# EAGLE design cmoy (EAGLE 6.4)
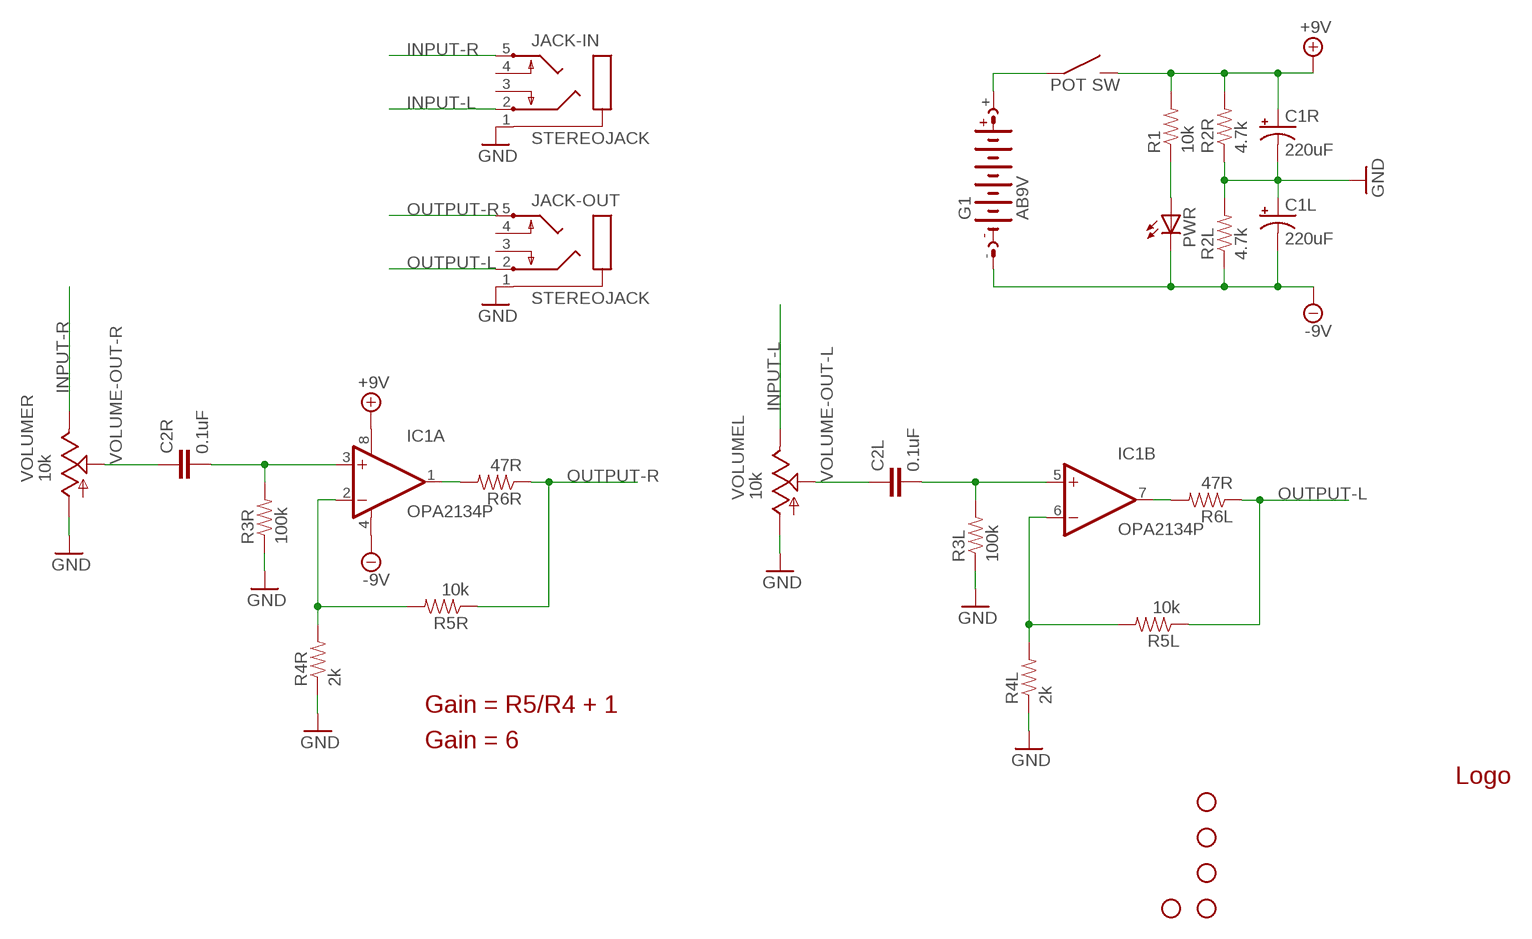
[diagram p0: schematic, sheet 1]

## Parts
C1L  220uF  CAP_POL-RADIAL-6.3MM  [CPOL-RADIAL-6.3MM]
C1R  220uF  CAP_POL-RADIAL-6.3MM  [CPOL-RADIAL-6.3MM]
C2L  0.1uF  CAP-VIMA-MKS2D031001  [CAP-PTH-VIMA-MKS2C031001A00KSSD]
C2R  0.1uF  CAP-VIMA-MKS2D031001  [CAP-PTH-VIMA-MKS2C031001A00KSSD]
G1  AB9V  [AB9V]
IC1  OPA2134P  [DIL-8]
JACK-IN  STEREOJACK  [STX3100]
JACK-OUT  STEREOJACK  [STX3100]
JP1  STAND-OFF  [STAND-OFF]
JP2  STAND-OFF  [STAND-OFF]
JP3  STAND-OFF  [STAND-OFF]
JP4  STAND-OFF  [STAND-OFF]
JP5  STAND-OFF  [STAND-OFF]
PWR  LED-3MM-MINUS  [LED3MM-MINUS]
R1  10k  RESISTOR-PTH-1/6W-OUTLINE  [1/6W-RES-OUTLINE]
R2L  4.7k  RESISTOR-PTH-1/6W-OUTLINE  [1/6W-RES-OUTLINE]
R2R  4.7k  RESISTOR-PTH-1/6W-OUTLINE  [1/6W-RES-OUTLINE]
R3L  100k  RESISTOR-PTH-1/4W-OUTLINE  [1/4W-RES-OUTLINE]
R3R  100k  RESISTOR-PTH-1/4W-OUTLINE  [1/4W-RES-OUTLINE]
R4L  2k  RESISTOR-PTH-1/4W-OUTLINE  [1/4W-RES-OUTLINE]
R4R  2k  RESISTOR-PTH-1/4W-OUTLINE  [1/4W-RES-OUTLINE]
R5L  10k  RESISTOR-PTH-1/4W-OUTLINE  [1/4W-RES-OUTLINE]
R5R  10k  RESISTOR-PTH-1/4W-OUTLINE  [1/4W-RES-OUTLINE]
R6L  47R  RESISTOR-PTH-1/4W-OUTLINE  [1/4W-RES-OUTLINE]
R6R  47R  RESISTOR-PTH-1/4W-OUTLINE  [1/4W-RES-OUTLINE]
U$1  OSHW-LOGO-OUTLINE  [OSHW-LOGO-OUTLINE]
VOLUME  10k  ALPS_RK0971221Z0N  [ALPS_RK0971221Z0X]

## Nets
+9V: C1R.1(+) IC1.8(A:V+) R1.2 R2R.2 VOLUME.S2
-9V: C1L.2(-) G1.- IC1.4(A:V-) PWR.K(C) R2L.1
GND: C1L.1(+) C1R.2(-) JACK-IN.1 JACK-OUT.1 R2L.2 R2R.1 R3L.P$1 R3R.P$1 R4L.P$1 R4R.P$1 VOLUME.G1 VOLUME.G2
INPUT-L: JACK-IN.2 VOLUME.I1
INPUT-R: JACK-IN.5 VOLUME.I2
L+: C2L.2 IC1.5(B:+IN) R3L.P$2
L-: IC1.6(B:-IN) R4L.P$2 R5L.P$2
N$1: PWR.A R1.1
N$3: G1.+ VOLUME.S1
OP-L: IC1.7(B:OUT) R6L.P$2
OP-R: IC1.1(A:OUT) R6R.P$2
OUTPUT-L: JACK-OUT.2 R5L.P$1 R6L.P$1
OUTPUT-R: JACK-OUT.5 R5R.P$1 R6R.P$1
R+: C2R.2 IC1.3(A:+IN) R3R.P$2
R-: IC1.2(A:-IN) R4R.P$2 R5R.P$2
VOLUME-OUT-L: C2L.1 VOLUME.O1
VOLUME-OUT-R: C2R.1 VOLUME.O2
Unconnected: JACK-IN.3 JACK-IN.4 JACK-OUT.3 JACK-OUT.4

## Notes on the sheet
- Gain = R5/R4 + 1
- Gain = 6

## Library data of the parts
C1L C1R = akafugu:CAP_POL: Capacitor Polarized These are standard SMD and PTH capacitors. Normally 10uF, 47uF, and 100uF in electrolytic and tantalum varieties. Always verify the external diameter of the through hole cap, it varies with capacity, voltage, and manufacturer. The EIA devices should be standard.
C2L C2R = akafugu:CAP: Capacitor Standard 0603 ceramic capacitor, and 0.1" leaded capacitor.
G1 = battery:AB9V: 9-V BATTERY CLIP
IC1 = akafugu:OPA2134: Operational Amplifier
JACK-IN JACK-OUT = akafugu:STEREOJACK: MIC/HEADPHONE JACK Stereo jack with two switches. Kycon STX3100, CUI SJ1-3555NG and/or 4UCon 05544
JP1-JP5 = SparkFun:STAND-OFF: Stand Off This is the mechanical footprint for a #4 phillips button head screw. Use the keepout ring to avoid running the screw head into surrounding components. SKU : PRT-00447
PWR = akafugu:LED: LEDs Standard schematic elements and footprints for 5mm, 3mm, 1206, and 0603 sized LEDs. 5mm - Spark Fun Electronics SKU : COM-00529 (and others)
R1 R2L R2R R3L R3R R4L R4R R5L R5R R6L R6R = akafugu:RESISTOR: Resistor Basic schematic elements and footprints for 0603, 1206, and PTH resistors.
U$1 = akafugu:OSHW-LOGO
VOLUME = audio-pots:ALPS_RK0971221Z0*: ALPS RK0971221Z Dual-gang 9mm potentiometer for volume control, with SPST switch -05 model: 10K with "volume" taper -0N model: 50K with traditional audio taper

## Net classes
0 default: width 0.254 mm, drill 0.305 mm, clearance 0.152 mm

## Board
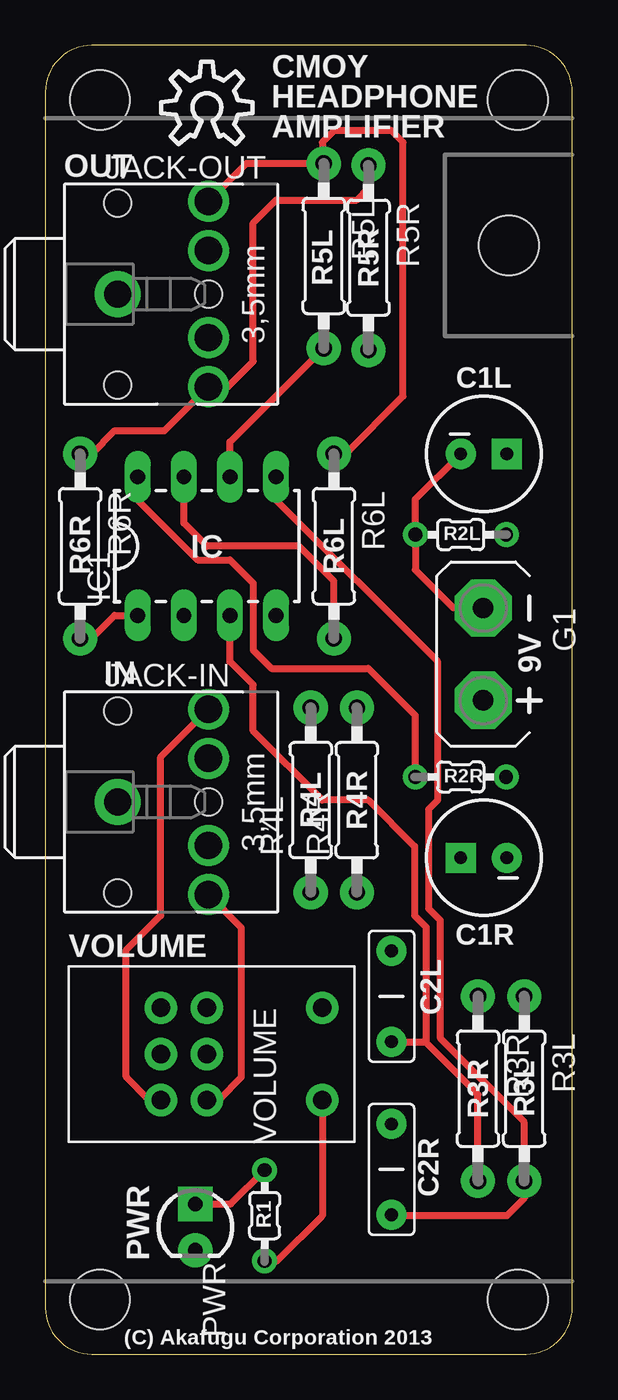
[diagram p1: board, top side]
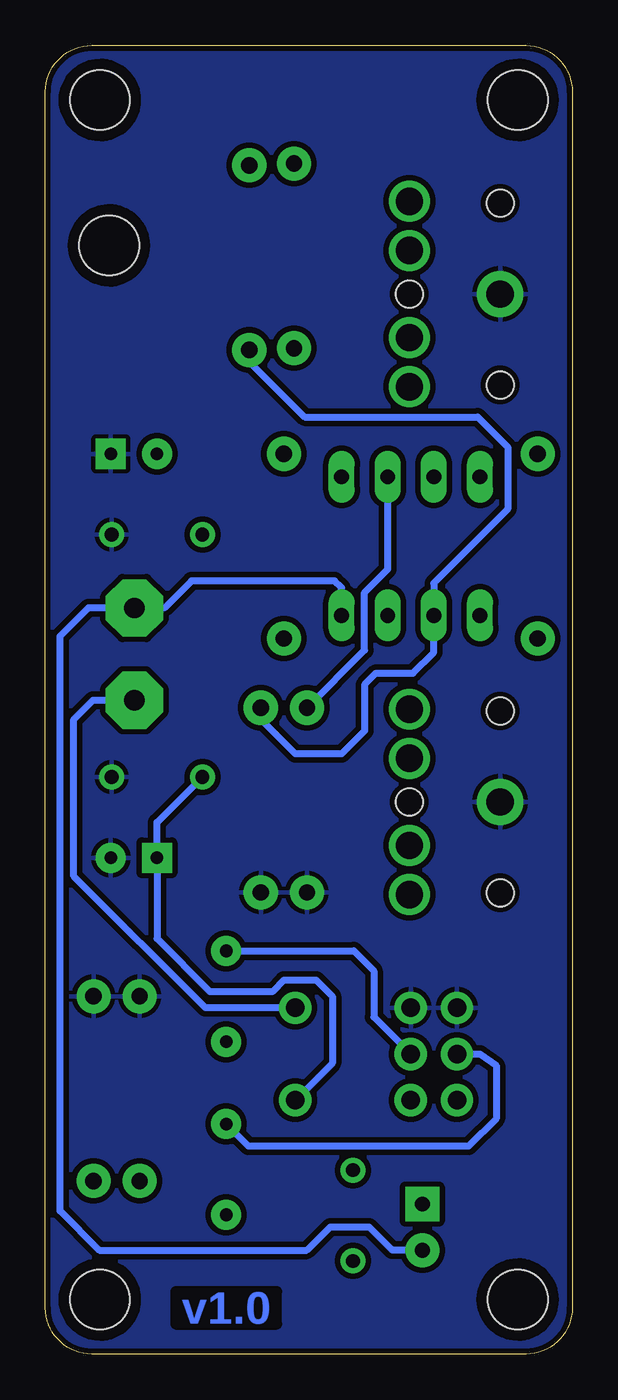
[diagram p2: board, bottom side, seen from below]

Size 29 x 72 mm. Coordinates in mm from the lower left corner, seen from the top.
Outline: 0,69.46 0,2.54 arc90 2.54,0 26.46,0 arc90 29,2.54 29,69.46 arc90 26.46,72 2.54,72 arc90 0,69.46
Copper layers (1*16): Top 0.035mm / dielectric 1.5mm / Bottom 0.035mm
Design rules "default": minimum track width 10mil, minimum drill 12mil, track to track 8mil, track to pad 8mil, pad to pad 8mil, via to via 8mil, smd to smd 0mil, copper to edge 12mil, drill to drill 10mil, minimum pad ring 12mil, minimum via ring 6mil, stop-mask expansion 2mil, vias tented up to drill 45mil, thermal gap 10mil

### Footprints (pad centres in the part's own frame; a part is rotated, then mirrored left to right if it is on the bottom)
CPOL-RADIAL-6.3MM = drill 0.7 pad 1.651 square: 1 1.27,0 | drill 0.7 pad 1.651: 2 -1.27,0
CAP-PTH-VIMA-MKS2C031001A00KSSD = drill 0.7 pad 1.651: 1 -2.5,0; 2 2.5,0
AB9V = drill 1.118 pad 3.15 octagon: + 0,2.54; - 0,-2.54
DIL-8 = drill 0.813 long: 1 -3.81,-3.81; 2 -1.27,-3.81; 3 1.27,-3.81; 4 3.81,-3.81; 5 3.81,3.81; 6 1.27,3.81; 7 -1.27,3.81; 8 -3.81,3.81
STX3100 = drill 1.5 pad 2.54: 1 2.7,-0.1 | drill 1.5: 2 7.7,5; 3 7.7,2.3; 4 7.7,-2.5; 5 7.7,-5.2 | hole 1.5: 2.7,4.9; 2.7,-5.1; 7.7,-0.1
STAND-OFF = hole 3.302: 0,0
LED3MM-MINUS = drill 0.813 pad 1.88 square: A -1.27,0 | drill 0.813 pad 1.88: K 1.27,0
1/6W-RES-OUTLINE = drill 0.762: 1 -2.5,0; 2 2.5,0
1/4W-RES-OUTLINE = drill 0.9 pad 1.88: P$1 -5.08,0; P$2 5.08,0
ALPS_RK0971221Z0X = drill 1.016 pad 1.778: G1 2.54,-2.54; G2 0,-2.54; I1 2.54,2.54; I2 0,2.54; O1 2.54,0; O2 0,0; S1 -6.35,-2.54; S2 -6.35,2.54

### Placement (x,y rotation side)
C1L  24.13,49.53 0 top
C1R  24.13,27.3 180 top
C2L  19.05,10.16 270 top
C2R  19.05,19.68 270 top
G1  24.1,38.51 180 top
IC1  8.89,44.45 0 top
JACK-IN  1.27,30.48 0 top
JACK-OUT  1.27,58.42 0 top
JP1  3,3 0 top
JP2  3,69 0 top
JP3  26,69 0 top
JP4  26,3 0 top
JP5  25.5,61 0 top
PWR  8.26,6.99 270 top
R1  12.06,7.62 270 top
R2L  22.86,45.09 0 top
R2R  22.86,31.75 180 top
R3L  26.35,14.61 270 top
R3R  23.81,14.61 270 top
R4L  14.61,30.48 90 top
R4R  17.14,30.48 90 top
R5L  15.32,60.42 270 top
R5R  17.78,60.33 270 top
R6L  15.88,44.45 270 top
R6R  1.91,44.45 270 top
U$1  8.89,68.58 0 top
VOLUME  8.89,16.51 180 top

### Tracks (layer width: path | path; a pad name or v marks a point on that pad's centre or on a via)
+9V
  Top 0.381: R1.2 12.74,5.12 15.24,7.62 VOLUME.S2 | IC1.8 5.08,46.99 8.38,43.69 10.16,43.69 11.43,42.42 11.43,38.73 12.45,37.72 17.78,37.72 20.36,35.14 R2R.2
  Bottom 0.381: VOLUME.S2 13.21,16 13.21,19.68 14.1,20.57 15.88,20.57 16.51,19.94 19.94,19.94 22.86,22.86 C1R.1 22.86,29.25 R2R.2
-9V
  Top 0.381: G1.- 22.45,41.05 20.36,43.14 R2L.1 20.36,47.03 C1L.2
  Bottom 0.381: PWR.K 9.91,5.71 11.18,6.99 13.34,6.99 14.61,5.71 26.04,5.71 28.19,7.87 28.19,39.5 26.64,41.05 G1.- 22.45,41.05 20.95,42.55 13.08,42.55 12.7,42.16 IC1.4
GND
  pour Bottom (isolate 0.305): -0.64,73.44 30.57,73.44 30.57,-0.64 -0.64,-0.64
INPUT-L
  Top 0.381: VOLUME.I1 5.71,13.97 4.45,15.24 4.45,22.23 6.35,24.13 6.35,32.86 JACK-IN.2
INPUT-R
  Top 0.381: JACK-IN.5 10.79,23.45 10.79,15.24 9.53,13.97 VOLUME.I2
L+
  Top 0.381: IC1.5 12.7,46.99 21.59,38.1 21.59,30.48 21.08,29.97 21.08,24.51 21.72,23.88 21.72,17.4 26.35,12.76 R3L.P$2 26.35,8.57 25.4,7.62 19.09,7.62 C2L.2
L-
  Top 0.381: IC1.6 10.16,50.18 R5L.P$2
  Bottom 0.381: IC1.6 10.16,43.18 11.43,41.91 11.43,38.73 R4L.P$2
N$1
  Top 0.381: PWR.A 10.2,8.26 R1.1
N$3
  Bottom 0.381: G1.+ 26.39,35.97 27.43,34.92 27.43,26.29 20.19,19.05 VOLUME.S1
OP-L
  Top 0.381: R6L.P$2 15.88,42.55 13.97,44.45 8.89,44.45 7.62,45.72 IC1.7
OP-R
  Top 0.381: R6R.P$2 2.54,39.37 3.81,40.64 IC1.1
OUTPUT-L
  Top 0.381: JACK-OUT.2 11.05,65.5 R5L.P$1 15.24,65.58 15.24,66.67 15.88,67.31 19.05,67.31 19.68,66.67 19.68,52.7 16.51,49.53 R6L.P$1
OUTPUT-R
  Top 0.381: R5R.P$1 17.78,64.14 17.14,63.5 12.7,63.5 11.43,62.23 11.43,54.61 10.04,53.22 JACK-OUT.5 6.55,50.8 3.81,50.8 2.54,49.53 R6R.P$1
R+
  Top 0.381: IC1.3 10.16,38.1 11.43,36.83 11.43,34.29 15.24,30.48 17.78,30.48 20.32,27.94 20.32,24.13 20.95,23.5 20.95,17.23 20.91,17.18 | R3R.P$2 23.81,14.29 20.91,17.18 | C2R.2 20.91,17.18
R-
  Bottom 0.381: R5R.P$2 17.78,54.61 14.73,51.56 5.21,51.56 3.56,49.91 3.56,46.48 7.62,42.42 IC1.2 7.62,38.61 8.76,37.47 10.79,37.47 11.43,36.83 11.43,34.29 12.7,33.02 15.24,33.02 17.14,34.92 R4R.P$2
VOLUME-OUT-L
  Bottom 0.381: VOLUME.O1 5.08,16.51 4.19,15.88 4.19,12.95 5.71,11.43 17.82,11.43 C2L.1
VOLUME-OUT-R
  Bottom 0.381: VOLUME.O2 10.92,18.54 10.92,21.08 12.03,22.18 C2R.1

### Text on the board
Bottom: v1.0
tPlace: CMOY | HEADPHONE | AMPLIFIER | OUT | R5L | R5R | C1L | R6R | R2L | IC | R6L | IN | R2R | R4L | R4R | C1R | VOLUME | C2L | R3R | R3L | C2R | R1 | PWR | (C) Akafugu Corporation 2013